# Altium schematic sheet [09] - DVI.SchDoc: IMXBB
size A3; DocumentNumber: 9; Revision: 2.0; SheetNumber: 9; SheetTotal: 13
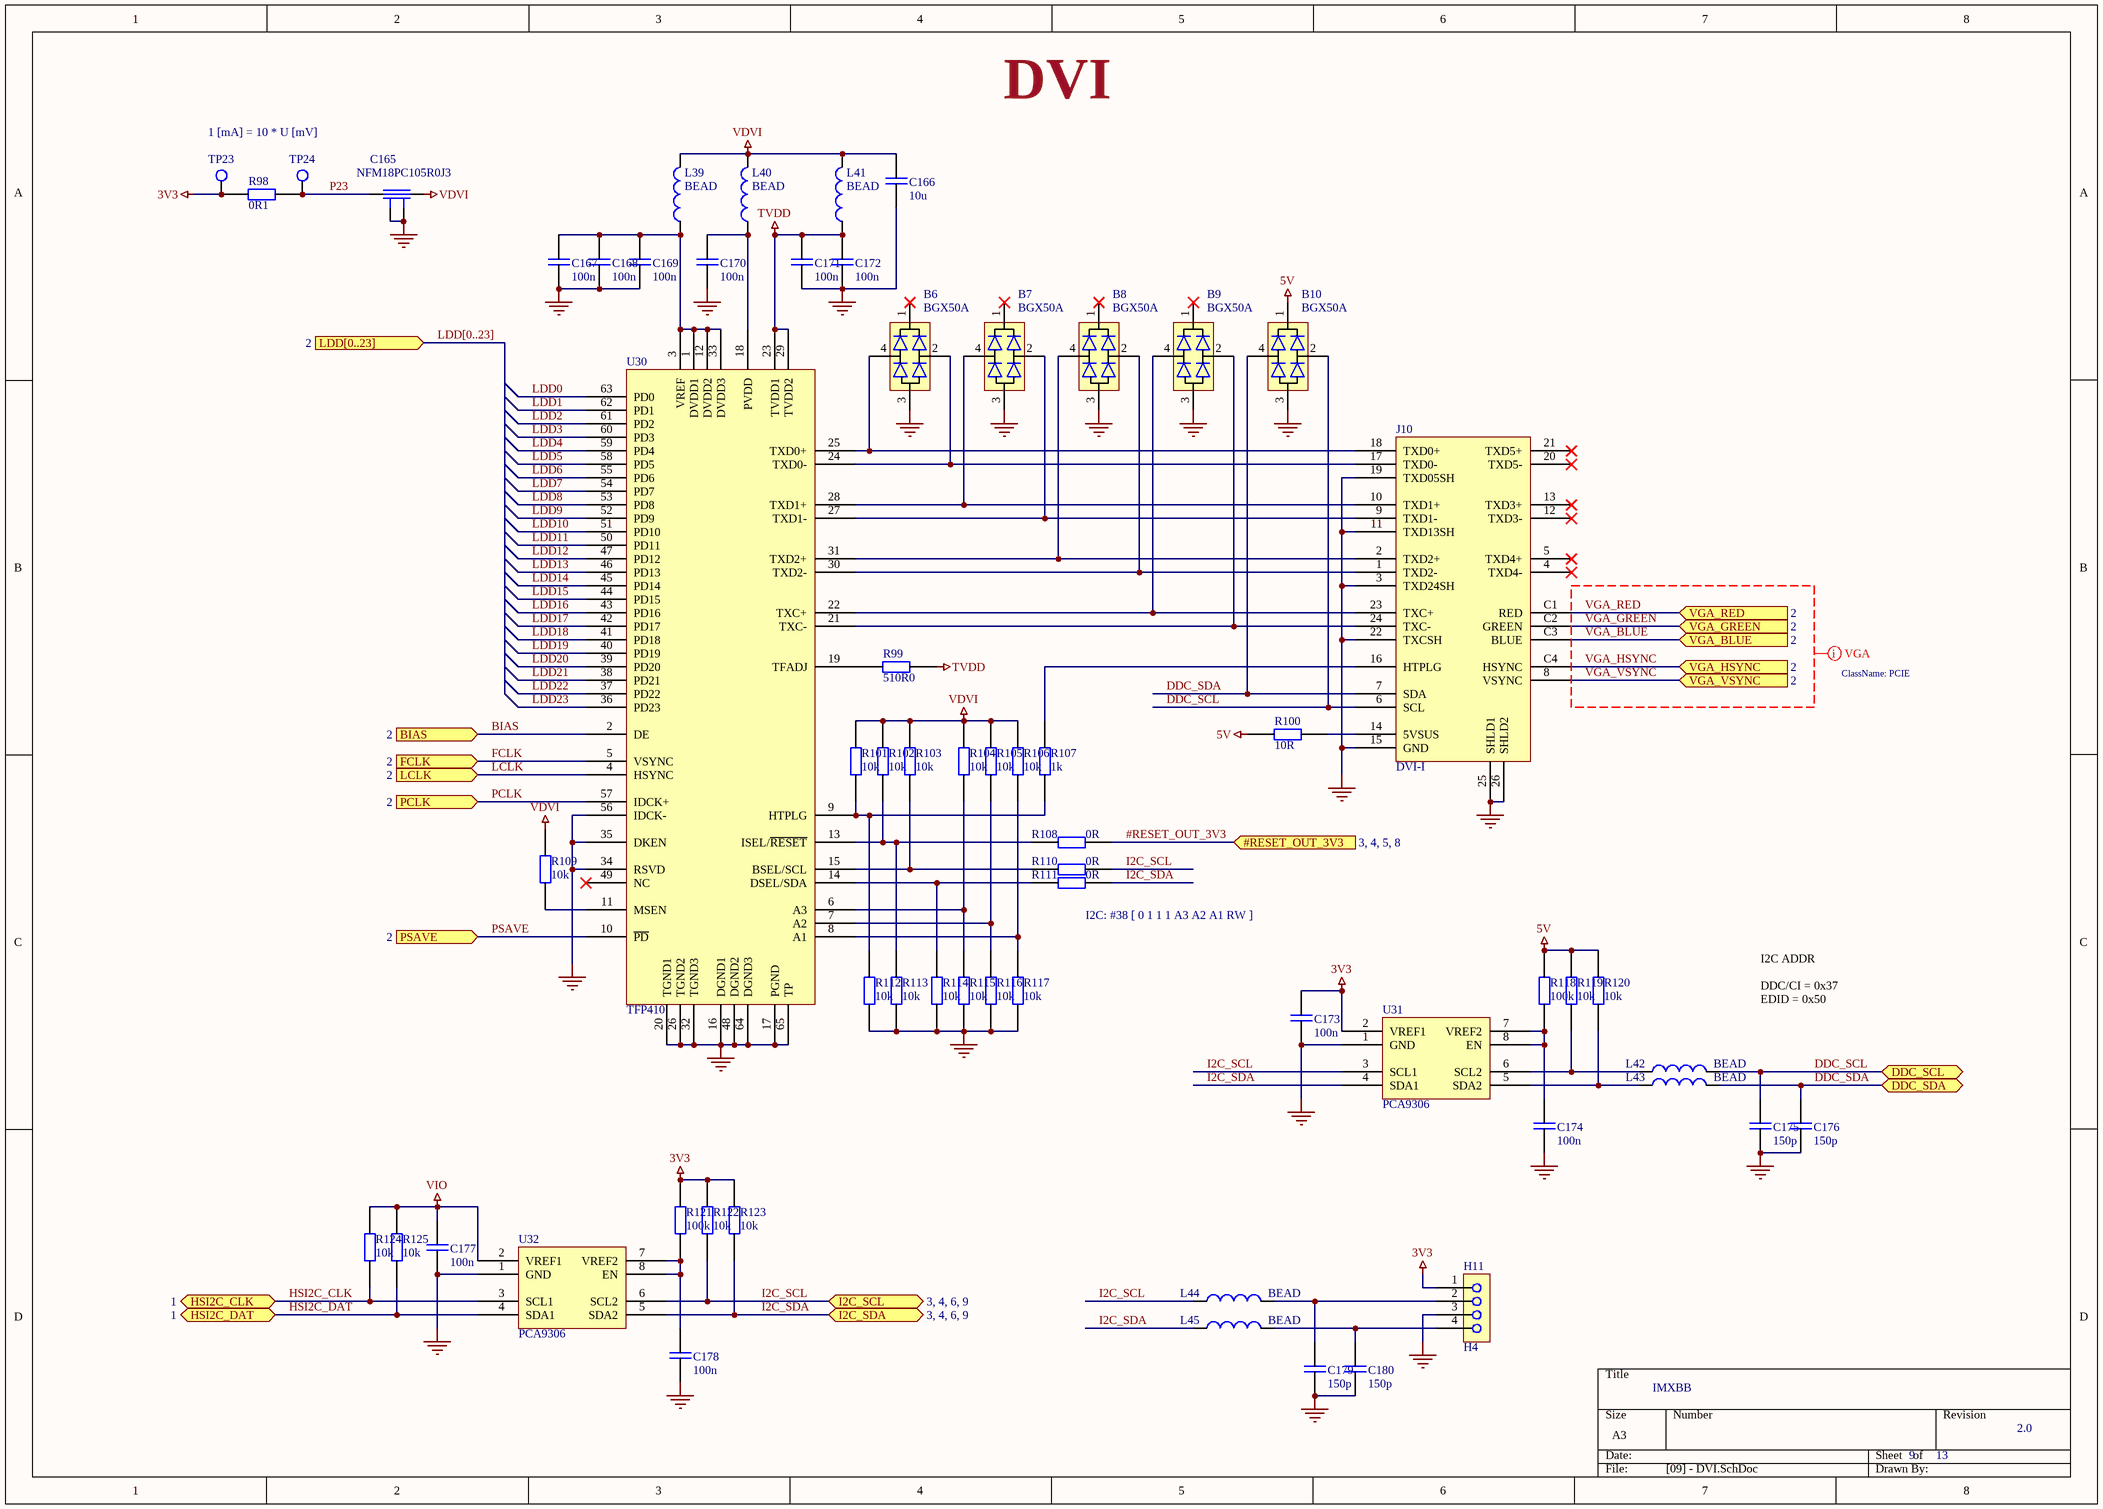
[diagram p0: [09] - DVI.SchDoc]

## Parts
B6  BGX50A  [SOT143]
B7  BGX50A  [SOT143]
B8  BGX50A  [SOT143]
B9  BGX50A  [SOT143]
B10  BGX50A  [SOT143]
C165  NFM18PC105R0J3  [NFM18P]
C166  10u  [0805]
C167  100n  [0603]
C168  100n  [0603]
C169  100n  [0603]
C170  100n  [0603]
C171  100n  [0603]
C172  100n  [0603]
C173  100n  [0603]
C174  100n  [0603]
C175  150p  [0603]
C176  150p  [0603]
C177  100n  [0603]
C178  100n  [0603]
C179  150p  [0603]
C180  150p  [0603]
H11  H4  [H1x4]
J10  DVI-I  [DVI_F_RA]
L39  BEAD  [0603]
L40  BEAD  [0603]
L41  BEAD  [0603]
L42  BEAD  [0603]
L43  BEAD  [0603]
L44  BEAD  [0603]
L45  BEAD  [0603]
R98  0R1  [0603]
R99  510R0  [0603]
R100  10R  [0603]
R101  10k  [0603]
R102  10k  [0603]
R103  10k  [0603]
R104  10k  [0603]
R105  10k  [0603]
R106  10k  [0603]
R107  1k  [0603]
R108  0R  [0603]
R109  10k  [0603]
R110  0R  [0603]
R111  0R  [0603]
R112  10k  [0603]
R113  10k  [0603]
R114  10k  [0603]
R115  10k  [0603]
R116  10k  [0603]
R117  10k  [0603]
R118  100k  [0603]
R119  10k  [0603]
R120  10k  [0603]
R121  100k  [0603]
R122  10k  [0603]
R123  10k  [0603]
R124  10k  [0603]
R125  10k  [0603]
TP23  TESTPOINT  [TESTPOINT_2mm]  (value not drawn)
TP24  TESTPOINT  [TESTPOINT_2mm]  (value not drawn)
U30  TFP410  [TQFP64]
U31  PCA9306  [TSSOP8]
U32  PCA9306  [TSSOP8]

## Ports
#RESET_OUT_3V3 (in, see 3, 4, 5, 8), BIAS (in, see 2), DDC_SCL (bidir), DDC_SDA (bidir), FCLK (in, see 2), HSI2C_CLK (bidir, see 1), HSI2C_DAT (bidir, see 1), I2C_SCL (bidir, see 3, 4, 6, 9), I2C_SDA (bidir, see 3, 4, 6, 9), LCLK (in, see 2), LDD[0..23] (in, see 2), PCLK (in, see 2), PSAVE (in, see 2), VGA_BLUE (in, see 2), VGA_GREEN (in, see 2), VGA_HSYNC (in, see 2), VGA_RED (in, see 2), VGA_VSYNC (in, see 2)

## Nets
3V3: C173.2 H11.1 R98.1 R121.1 R122.1 R123.1 TP23.1 U31.2(VREF1)
5V: B10.1 R100.2 R118.1 R119.1 R120.1
GND: B6.3 B7.3 B8.3 B9.3 B10.3 C165.2 C165.4 C166.1 C167.1 C168.1 C169.1 C170.1 C171.1 C172.1 C173.1 C174.1 C175.1 C176.1 C177.1 C178.1 C179.1 C180.1 H11.3 J10.3(TXD24SH) J10.11(TXD13SH) J10.15(GND) J10.19(TXD05SH) J10.22(TXCSH) J10.25(SHLD1) J10.26(SHLD2) R112.2 R113.2 R114.1 R115.2 R116.2 R117.2 U30.16(DGND1) U30.17(PGND) U30.20(TGND1) U30.26(TGND2) U30.32(TGND3) U30.34(RSVD) U30.35(DKEN) U30.48(DGND2) U30.56(IDCK-) U30.64(DGND3) U30.65(TP) U31.1(GND) U32.1(GND)
TVDD: C171.2 C172.2 L41.1 R99.1 U30.23(TVDD1) U30.29(TVDD2)
VDVI: C165.3 C166.2 L39.2 L40.2 L41.2 R101.1 R102.1 R103.1 R104.1 R105.1 R106.1 R109.1
VIO: C177.2 R124.1 R125.1 U32.2(VREF1)
#RESET_OUT_3V3: R108.1 ; port #RESET_OUT_3V3
BIAS: U30.2(DE) ; port BIAS
DDC_SCL: B10.2 C175.2 J10.6(SCL) L42.2 ; port DDC_SCL
DDC_SDA: B10.4 C176.2 J10.7(SDA) L43.2 ; port DDC_SDA
FCLK: U30.5(VSYNC) ; port FCLK
HSI2C_CLK: R124.2 U32.3(SCL1) ; port HSI2C_CLK
HSI2C_DAT: R125.2 U32.4(SDA1) ; port HSI2C_DAT
I2C_SCL: L44.1 R110.1 R122.2 U31.3(SCL1) U32.6(SCL2) ; port I2C_SCL
I2C_SDA: L45.1 R111.1 R123.2 U31.4(SDA1) U32.5(SDA2) ; port I2C_SDA
LCLK: U30.4(HSYNC) ; port LCLK
LDD0: U30.63(PD0)
LDD1: U30.62(PD1)
LDD2: U30.61(PD2)
LDD3: U30.60(PD3)
LDD4: U30.59(PD4)
LDD5: U30.58(PD5)
LDD6: U30.55(PD6)
LDD7: U30.54(PD7)
LDD8: U30.53(PD8)
LDD9: U30.52(PD9)
LDD10: U30.51(PD10)
LDD11: U30.50(PD11)
LDD12: U30.47(PD12)
LDD13: U30.46(PD13)
LDD14: U30.45(PD14)
LDD15: U30.44(PD15)
LDD16: U30.43(PD16)
LDD17: U30.42(PD17)
LDD18: U30.41(PD18)
LDD19: U30.40(PD19)
LDD20: U30.39(PD20)
LDD21: U30.38(PD21)
LDD22: U30.37(PD22)
LDD23: U30.36(PD23)
P23: C165.1 R98.2 TP24.1
PCLK: U30.57(IDCK+) ; port PCLK
PSAVE: U30.10(~{PD}) ; port PSAVE
VGA_BLUE: J10.C3(BLUE) ; port VGA_BLUE
VGA_GREEN: J10.C2(GREEN) ; port VGA_GREEN
VGA_HSYNC: J10.C4(HSYNC) ; port VGA_HSYNC
VGA_RED: J10.C1(RED) ; port VGA_RED
VGA_VSYNC: J10.8(VSYNC) ; port VGA_VSYNC
NetB6_2: B6.2 J10.17(TXD0-) U30.24(TXD0-)
NetB6_4: B6.4 J10.18(TXD0+) U30.25(TXD0+)
NetB7_2: B7.2 J10.9(TXD1-) U30.27(TXD1-)
NetB7_4: B7.4 J10.10(TXD1+) U30.28(TXD1+)
NetB8_2: B8.2 J10.1(TXD2-) U30.30(TXD2-)
NetB8_4: B8.4 J10.2(TXD2+) U30.31(TXD2+)
NetB9_2: B9.2 J10.24(TXC-) U30.21(TXC-)
NetB9_4: B9.4 J10.23(TXC+) U30.22(TXC+)
NetC167_2: C167.2 C168.2 C169.2 L39.1 U30.1(DVDD1) U30.3(VREF) U30.12(DVDD2) U30.33(DVDD3)
NetC170_2: C170.2 L40.1 U30.18(PVDD)
NetC174_2: C174.2 R118.2 U31.7(VREF2) U31.8(EN)
NetC178_2: C178.2 R121.2 U32.7(VREF2) U32.8(EN)
NetC179_2: C179.2 H11.2 L44.2
NetC180_2: C180.2 H11.4 L45.2
NetJ10_14: J10.14(5VSUS) R100.1
NetJ10_16: J10.16(HTPLG) R107.1
NetL42_1: L42.1 R119.2 U31.6(SCL2)
NetL43_1: L43.1 R120.2 U31.5(SDA2)
NetR99_2: R99.2 U30.19(TFADJ)
NetR101_2: R101.2 R107.2 R112.1 U30.9(HTPLG)
NetR102_2: R102.2 R108.2 R113.1 U30.13(ISEL/~{RESET})
NetR103_2: R103.2 R110.2 U30.15(BSEL/SCL)
NetR104_2: R104.2 R115.1 U30.6(A3)
NetR105_2: R105.2 R116.1 U30.7(A2)
NetR106_2: R106.2 R117.1 U30.8(A1)
NetR109_2: R109.2 U30.11(MSEN)
NetR111_2: R111.2 R114.2 U30.14(DSEL/SDA)

Not connected (* = marked no-connect by the designer): B6 1*; B7 1*; B8 1*; B9 1*; J10 4(TXD4-)* 5(TXD4+)* 12(TXD3-)* 13(TXD3+)* 20(TXD5-)* 21(TXD5+)*; U30 49(NC)*

## Buses and harness runs
bus LDD[0..23] = port LDD[0..23]

## Layout directives
net class PCIE: VGA_BLUE, VGA_GREEN, VGA_HSYNC, VGA_RED, VGA_VSYNC

## Notes on the sheet
- DVI
- 1 [mA] = 10 * U [mV]
- I2C: #38 [ 0 1 1 1 A3 A2 A1 RW ]
- I2C ADDR
  DDC/CI	= 0x37
  EDID	= 0x50

## Library data of the parts
C165 = NFL21S: Chip EMIFIL; Producer: Murata; Order number: NFM18PC105R0J3; Component class: C; Assembly type: SMT
C166-C180 = C
L39-L45 = FBEAD
R98-R125 = R
TP23 TP24 = TESTPOINT: Testpoint pad; Order number: no component; Component class: TP; Producer: n/a; Assembly type: no component